# Altium project Active Sensor BB Rev 3.1old.PrjPcb
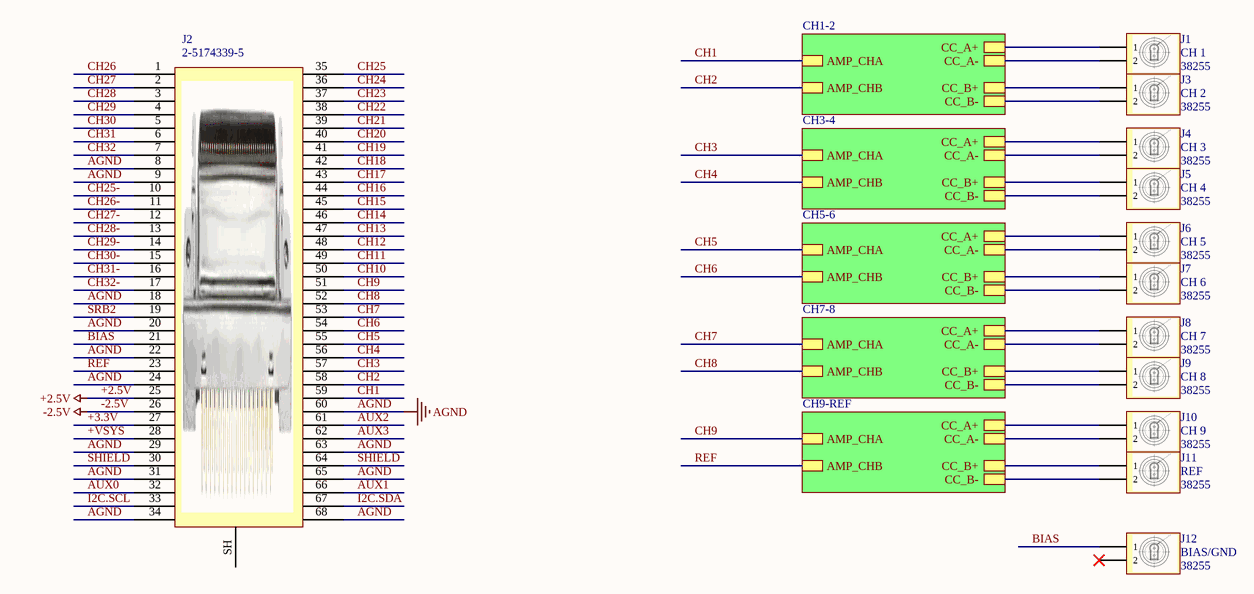
[diagram p0: Active Sensor BB.SchDoc]
PRJCOMPANY: X; PRJDATE: 12-18-18; PRJDOC: XXXXX; PRJENGINEER: N. HAMAN; PRJNAME: AMBER; PRJREV: 3.1
2 sheets, 107 parts. Net scope: hierarchical (ports join the sheet entries above them; power ports are global).
Board file: Active Sensor BB.PcbDoc
Sheets:
  Active Sensor BB.SchDoc
    CH1-2 = CC CHANNEL.SchDoc
    CH3-4 = CC CHANNEL.SchDoc
    CH5-6 = CC CHANNEL.SchDoc
    CH7-8 = CC CHANNEL.SchDoc
    CH9-REF = CC CHANNEL.SchDoc

## Sheet Active Sensor BB.SchDoc
size A4; Organization: Altium Limited; Address1: L3, 12a Rodborough Rd; Address2: Frenchs Forest; Address3: NSW; Address4: Australia 2086; SheetNumber: 1; SheetTotal: 2; TitleBlk1Sch: PCBA, A.E BREAKOUT, REV 3.1, AMBER; TitleBlk2Sch: Active Sensor Board; EngDate: 12-18-18; RevSch: 01; Eng: Haman

### Parts
J1  CH 1  [38255]
J2  10268-6212PC  [2-5174339-5]  (value not drawn)
J3  CH 2  [38255]
J4  CH 3  [38255]
J5  CH 4  [38255]
J6  CH 5  [38255]
J7  CH 6  [38255]
J8  CH 7  [38255]
J9  CH 8  [38255]
J10  CH 9  [38255]
J11  REF  [38255]
J12  BIAS/GND  [38255]

### Sub-sheets
CH1-2 = CC CHANNEL.SchDoc: CC_A+, CC_A-, AMP_CHA, AMP_CHB, CC_B+, CC_B-
CH3-4 = CC CHANNEL.SchDoc: CC_A+, CC_A-, AMP_CHA, AMP_CHB, CC_B+, CC_B-
CH5-6 = CC CHANNEL.SchDoc: CC_A+, CC_A-, AMP_CHA, AMP_CHB, CC_B+, CC_B-
CH7-8 = CC CHANNEL.SchDoc: CC_A+, CC_A-, AMP_CHA, AMP_CHB, CC_B+, CC_B-
CH9-REF = CC CHANNEL.SchDoc: CC_A+, CC_A-, AMP_CHA, AMP_CHB, CC_B+, CC_B-

### Nets
+2.5V: J2.25
-2.5V: J2.26
AGND: J2.8 J2.9 J2.18 J2.20 J2.22 J2.24 J2.29 J2.31 J2.34 J2.60 J2.63 J2.65 J2.68
+3.3V: J2.27
+VSYS: J2.28
AUX0: J2.32
AUX1: J2.66
AUX2: J2.61
AUX3: J2.62
BIAS: J2.21 J12.1
CC_A+: J1.1 ; sheet CH1-2/CC_A+
CC_A+: J4.1 ; sheet CH3-4/CC_A+  [a separate net that carries the same name]
CC_A+: J6.1 ; sheet CH5-6/CC_A+  [a separate net that carries the same name]
CC_A+: J8.1 ; sheet CH7-8/CC_A+  [a separate net that carries the same name]
CC_A+: J10.1 ; sheet CH9-REF/CC_A+  [a separate net that carries the same name]
CC_A-: J1.2 ; sheet CH1-2/CC_A-
CC_A-: J4.2 ; sheet CH3-4/CC_A-  [a separate net that carries the same name]
CC_A-: J6.2 ; sheet CH5-6/CC_A-  [a separate net that carries the same name]
CC_A-: J8.2 ; sheet CH7-8/CC_A-  [a separate net that carries the same name]
CC_A-: J10.2 ; sheet CH9-REF/CC_A-  [a separate net that carries the same name]
CC_B+: J3.1 ; sheet CH1-2/CC_B+
CC_B+: J5.1 ; sheet CH3-4/CC_B+  [a separate net that carries the same name]
CC_B+: J7.1 ; sheet CH5-6/CC_B+  [a separate net that carries the same name]
CC_B+: J9.1 ; sheet CH7-8/CC_B+  [a separate net that carries the same name]
CC_B+: J11.1 ; sheet CH9-REF/CC_B+  [a separate net that carries the same name]
CC_B-: J3.2 ; sheet CH1-2/CC_B-
CC_B-: J5.2 ; sheet CH3-4/CC_B-  [a separate net that carries the same name]
CC_B-: J7.2 ; sheet CH5-6/CC_B-  [a separate net that carries the same name]
CC_B-: J9.2 ; sheet CH7-8/CC_B-  [a separate net that carries the same name]
CC_B-: J11.2 ; sheet CH9-REF/CC_B-  [a separate net that carries the same name]
CH1: J2.59 ; sheet CH1-2/AMP_CHA
CH2: J2.58 ; sheet CH1-2/AMP_CHB
CH3: J2.57 ; sheet CH3-4/AMP_CHA
CH4: J2.56 ; sheet CH3-4/AMP_CHB
CH5: J2.55 ; sheet CH5-6/AMP_CHA
CH6: J2.54 ; sheet CH5-6/AMP_CHB
CH7: J2.53 ; sheet CH7-8/AMP_CHA
CH8: J2.52 ; sheet CH7-8/AMP_CHB
CH9: J2.51 ; sheet CH9-REF/AMP_CHA
CH10: J2.50
CH11: J2.49
CH12: J2.48
CH13: J2.47
CH14: J2.46
CH15: J2.45
CH16: J2.44
CH17: J2.43
CH18: J2.42
CH19: J2.41
CH20: J2.40
CH21: J2.39
CH22: J2.38
CH23: J2.37
CH24: J2.36
CH25: J2.35
CH25-: J2.10
CH26: J2.1
CH26-: J2.11
CH27: J2.2
CH27-: J2.12
CH28: J2.3
CH28-: J2.13
CH29: J2.4
CH29-: J2.14
CH30: J2.5
CH30-: J2.15
CH31: J2.6
CH31-: J2.16
CH32: J2.7
CH32-: J2.17
I2C.SCL: J2.33
I2C.SDA: J2.67
REF: J2.23 ; sheet CH9-REF/AMP_CHB
SHIELD: J2.30 J2.64
SRB2: J2.19

Not connected (* = marked no-connect by the designer): J2 SH; J12 2*

### Notes on the sheet
- Title:
- USA
- 100 Mayfield Avenue
- Mountain View, CA 94043
- Variant Name:
- Confidential and Proprietary
- Engineer:
- Date:
- Size:
- A4
- Template:
- 992-00283-00 A
- Dwg No:
- Sheet:
- Rev:
- of

### Library data of the parts
J1 J3-J12 = 38255: MANUFACTURER: PLASTICS1; DESCRIPTION1: TOUCHLESS CONNECTOR; MANUFACTURER PART NUMBER: 38255
J2 = 10268-6212PC: Manufacturer: TE Connectivity; Description1: TE CONNECTIVITY / AMP         2-5174339-5             Standard D Sub Connector, Vertical, AMPLIMITE 0.050 Series, Plug, 68 Contacts, Steel Body; 3D Model: 2-5174339-5.pdf; Connector Style: D-Type; Connector Type: Cap, Male Pins; Number of Positions: 68; Flange Feature: Housing/Shell (M2.5); Voltage Rating: 100V; Current Rating: 1A; Supplier 1: Digi-Key; Supplier Part Number 1: A121355-ND; Manufacturer Part Number: 2-5174339-5; Stock 1: 1867; Pricing 1: 1=20.4, 10=18.414, 25=17.6424, 50=16.5398, 100=15.9885, 250=15.1064, 500=14.6653 (USD); RoHS Information: 2-5174339-5 Statement of Compliance; Standard Package: 420; Category: Connectors, Interconnects; Family: D-Sub Connectors; Series: AMPLIMITE .050 II; Number of Rows: 2; Shell Size, Connector Layout: 0.050 Pitch x 0.100 Row to Row; Contact Type: Signal; Mounting Type: Through Hole; Termination: Solder; Features: Shielded; Shell Material, Finish: Zinc, Nickel Plated; Contact Finish: Gold; Contact Finish Thickness: 30µin (0.76µm); Operating Temperature: -55°C ~ 85°C; Housing Material: Polybutylene Terephthalate (PBT); Color: Black

## Sheet CC CHANNEL.SchDoc
size A4; Organization: Altium Limited; Address1: L3, 12a Rodborough Rd; Address2: Frenchs Forest; Address3: NSW; Address4: Australia 2086; SheetNumber: 2; SheetTotal: 2; TitleBlk1Sch: PCBA, A.E BREAKOUT, REV 3.1, AMBER; TitleBlk2Sch: CC Channel; Eng: Haman; RevSch: 01; EngDate: 12-18-19
Used 5 times, as channels CH1-2, CH3-4, CH5-6, CH7-8, CH9-REF. Parts and nets are listed once, with the designators drawn on the sheet.
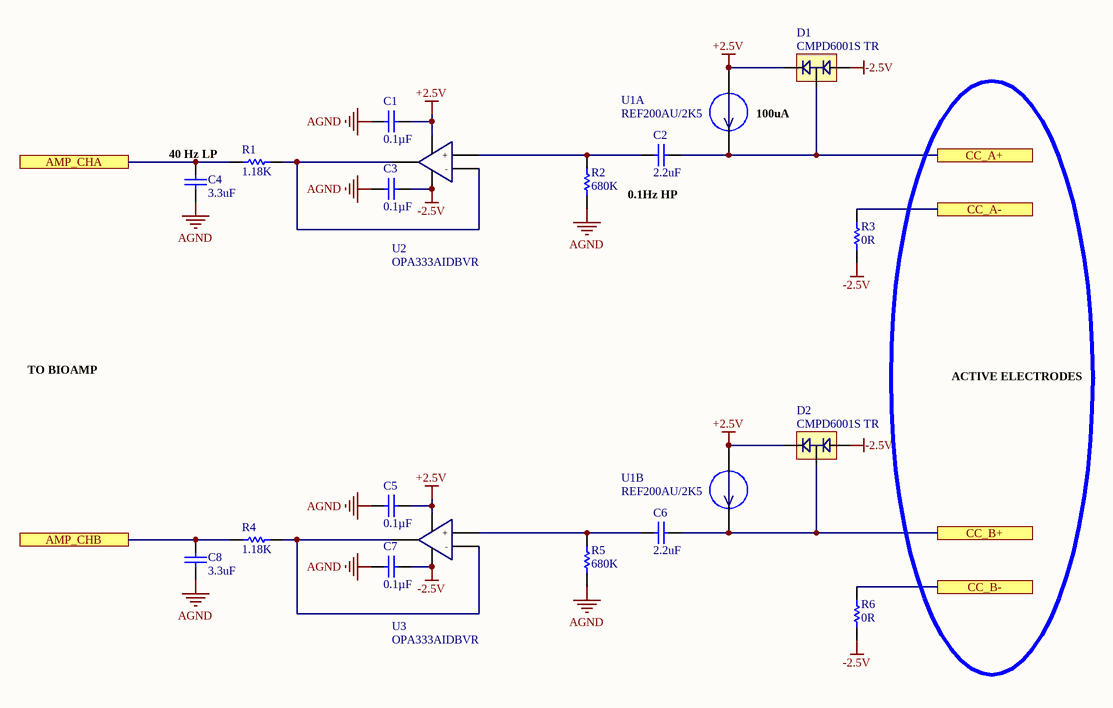
[diagram p1: CC CHANNEL.SchDoc]

### Parts
C1  Capacitance: 0.1µF  [0805C]
C2  Capacitance: 2.2uF  [0805C]  (hidden comment: 50V)
C3  Capacitance: 0.1µF  [0805C]
C4  Capacitance: 3.3uF  [0805C]
C5  Capacitance: 0.1µF  [0805C]
C6  Capacitance: 2.2uF  [0805C]  (hidden comment: 50V)
C7  Capacitance: 0.1µF  [0805C]
C8  Capacitance: 3.3uF  [0805C]
D1  CMPD6001S TR  [SOT-23]
D2  CMPD6001S TR  [SOT-23]
R1  Resistance (Ohms): 1.18K  [0805R]  (hidden comment: Res 0805)
R2  Resistance (Ohms): 680K  [0805R]  (hidden comment: Res 0805)
R3  Resistance (Ohms): 0R  [0805R]  (hidden comment: Res 0805)
R4  Resistance (Ohms): 1.18K  [0805R]  (hidden comment: Res 0805)
R5  Resistance (Ohms): 680K  [0805R]  (hidden comment: Res 0805)
R6  Resistance (Ohms): 0R  [0805R]  (hidden comment: Res 0805)
U1  REF200AU/2K5  [SOIC-8]  (parts A,B of 2)
U2  Manufacturer Part Number: OPA333AIDBVR  [SOT-23-5]  (hidden comment: LPV821DBVR)
U3  Manufacturer Part Number: OPA333AIDBVR  [SOT-23-5]  (hidden comment: LPV821DBVR)

### Ports
AMP_CHA, AMP_CHB, CC_A+, CC_A-, CC_B+, CC_B-

### Nets
+2.5V: C1.2 C5.2 D1.2 D2.2 U1.7(I2_HIGH) U1.8(I1_HIGH) U2.5(VCC) U3.5(VCC)
-2.5V: C3.2 C7.2 D1.1 D2.1 R3.1 R6.1 U2.2(VDD) U3.2(VDD)
AGND: C1.1 C3.1 C4.1 C5.1 C7.1 C8.1 R2.1 R5.1
AMP_CHA: C4.2 R1.2 ; port AMP_CHA
AMP_CHB: C8.2 R4.2 ; port AMP_CHB
CC_A+: C2.1 D1.3 U1.1(I1_LOW) ; port CC_A+
CC_A-: R3.2 ; port CC_A-
CC_B+: C6.1 D2.3 U1.2(I2_LOW) ; port CC_B+
CC_B-: R6.2 ; port CC_B-
NetC2_2: C2.2 R2.2 U2.3(+)
NetC6_2: C6.2 R5.2 U3.3(+)
NetR1_1: R1.1 U2.1(OUT) U2.4(-)
NetR4_1: R4.1 U3.1(OUT) U3.4(-)

### Channels
CH1-2: designators end in A; ports AMP_CHA=CH1 AMP_CHB=CH2 CC_A+=CC_A+ CC_A-=CC_A- CC_B+=CC_B+ CC_B-=CC_B-
CH3-4: designators end in B; ports AMP_CHA=CH3 AMP_CHB=CH4 CC_A+=CC_A+ CC_A-=CC_A- CC_B+=CC_B+ CC_B-=CC_B-
CH5-6: designators end in C; ports AMP_CHA=CH5 AMP_CHB=CH6 CC_A+=CC_A+ CC_A-=CC_A- CC_B+=CC_B+ CC_B-=CC_B-
CH7-8: designators end in D; ports AMP_CHA=CH7 AMP_CHB=CH8 CC_A+=CC_A+ CC_A-=CC_A- CC_B+=CC_B+ CC_B-=CC_B-
CH9-REF: designators end in E; ports AMP_CHA=CH9 AMP_CHB=REF CC_A+=CC_A+ CC_A-=CC_A- CC_B+=CC_B+ CC_B-=CC_B-

### Notes on the sheet
- 100uA
- (near C4) 40 Hz LP
- 0.1Hz HP
- TO BIOAMP
- ACTIVE ELECTRODES
- Title:
- USA
- 100 Mayfield Avenue
- Mountain View, CA 94043
- Variant Name:
- Confidential and Proprietary
- Engineer:
- Date:
- Size:
- A4
- Template:
- 992-00283-00 A
- Dwg No:
- Sheet:
- Rev:
- of

### Library data of the parts
C1 C3 C5 C7 = Cap: CAP .1UF 50V CERAMIC Y5V 0805; Manufacturer: AVX Corporation; Manufacturer Part Number: 08055C104KAT2A; Description1: CAP CER 0.1UF 50V X7R 0805; Tolerance: ±10%; Temperature Coefficient: X7R; Revision: July-2002: Re-released for DXP Platform.; Supplier 1: Digi-Key; Supplier Part Number 1: 478-1395-1-ND; RoHS: RoHS Compliant; Category: Capacitors; Stock 1: 5022563; Pricing 1: 1=0.1, 10=0.036, 25=0.0264, 50=0.0198, 100=0.0162, 250=0.01352, 500=0.01156, 1000=0.00908 (USD); Packaging: Cut Tape (CT); Part Status: Active; Voltage - Rated: 50V; Mounting Type: Surface Mount, MLCC; Operating Temperature: -55°C ~ 125°C; Applications: General Purpose; Ratings: -; Package / Case: 0805 (2012 Metric); Size / Dimension: 0.079" L x 0.049" W (2.01mm x 1.25mm); Height - Seated (Max): -; Thickness (Max): 0.037" (0.94mm); Lead Spacing: -; Features: -; Lead Style: -; ComponentLink1URL: http://datasheets.avx.com/X7RDielectric.pdf; ComponentLink1Description: http://datasheets.avx.com/X7RDielectric.pdf
C2 C6 = Cap: CAP .1UF 50V CERAMIC Y5V 0805; Manufacturer: Yageo; Manufacturer Part Number: CC0805MRX5R6BB225; Description1: CAP CER 2.2UF 10V X5R 0805; Tolerance: ±20%; Voltage - Rated: 10V; Temperature Coefficient: X5R; Notification: Current market demand for these product types have resulted in fluctuating and extending lead times. Lead times may differ.; Revision: July-2002: Re-released for DXP Platform.; Supplier 1: Digi-Key; Supplier Part Number 1: 311-3438-1-ND; RoHS: RoHS Compliant; Category: Capacitors; Stock 1: 31890; Pricing 1: 1=0.24, 10=0.161, 100=0.0818, 500=0.05598, 1000=0.04951 (USD); Packaging: Cut Tape (CT); Part Status: Active; Operating Temperature: -55°C ~ 85°C; Features: -; Ratings: -; Applications: General Purpose; Failure Rate: -; Mounting Type: Surface Mount, MLCC; Package / Case: 0805 (2012 Metric); Size / Dimension: 0.079" L x 0.049" W (2.00mm x 1.25mm); Height - Seated (Max): -; Thickness (Max): 0.037" (0.95mm); Lead Spacing: -; Lead Style: -; ComponentLink1URL: http://www.yageo.com/documents/recent/UPY-GPHC_X5R_4V-to-50V_25.pdf; ComponentLink1Description: http://www.yageo.com/documents/recent/UPY-GPHC_X5R_4V-to-50V_25.pdf
C4 C8 = Cap: CAP .1UF 50V CERAMIC Y5V 0805; Manufacturer: TDK Corporation; Manufacturer Part Number: CGA4J3X7R1C335K125AB; Description1: CAP CER 3.3UF 16V X7R 0805; Tolerance: ±10%; Voltage - Rated: 16V; Temperature Coefficient: X7R; Revision: July-2002: Re-released for DXP Platform.; Supplier 1: Digi-Key; Supplier Part Number 1: 445-12736-1-ND; RoHS: RoHS Compliant; Category: Capacitors; Stock 1: 20000; Pricing 1: 1=0.55, 10=0.38, 100=0.2277, 500=0.17078, 1000=0.14421 (USD); Packaging: Cut Tape (CT); Part Status: Active; Operating Temperature: -55°C ~ 125°C; Features: -; Ratings: AEC-Q200; Applications: Automotive; Failure Rate: -; Mounting Type: Surface Mount, MLCC; Package / Case: 0805 (2012 Metric); Size / Dimension: 0.079" L x 0.049" W (2.00mm x 1.25mm); Height - Seated (Max): -; Thickness (Max): 0.057" (1.45mm); Lead Spacing: -; Lead Style: -; ComponentLink1URL: https://product.tdk.com/info/en/catalog/datasheets/mlcc_automotive_general_en.pdf; ComponentLink1Description: https://product.tdk.com/info/en/catalog/datasheets/mlcc_automotive_general_en.pdf
D1 D2 = CMPD6001S TR: Manufacturer: Central Semiconductor Corp; Description1: DIODE ARRAY GP 75V 250MA SOT23; Diode Configuration: 1 Pair Series Connection; Diode Type: Standard; Voltage - DC Reverse (Vr) (Max): 75V; Current - Average Rectified (Io) (per Diode): 250mA; Voltage - Forward (Vf) (Max) @ If: 1.1V @ 100mA; Speed: Fast Recovery =< 500ns, > 200mA (Io); Reverse Recovery Time (trr): 3µs; Current - Reverse Leakage @ Vr: 500pA @ 75V; Supplier 1: Digi-Key; Supplier Part Number 1: CMPD6001S CT-ND; RoHS: RoHS Compliant; Category: Discrete Semiconductor Products; Stock 1: 7051; Pricing 1: 1=0.89, 10=0.872, 25=0.7868, 100=0.6885, 250=0.60376, 500=0.53548, 750=0.46717, 1000=0.42346 (USD); Packaging: Cut Tape (CT); Part Status: Active; Mounting Type: Surface Mount; Package / Case: TO-236-3, SC-59, SOT-23-3; Supplier Device Package: SOT-23; ComponentLink1URL: http://www.centralsemi.com/PDFs/products/CMPD6001-A-C-S_R1.PDF; ComponentLink1Description: http://www.centralsemi.com/PDFs/products/CMPD6001-A-C-S_R1.PDF; Manufacturer Part Number: CMPD6001S TR
R1 R4 = Res 0805: Resistor; Manufacturer: Yageo; Manufacturer Part Number: RC0805FR-071K18L; Description1: RES SMD 1.18K OHM 1% 1/8W 0805; Tolerance: ±1%; Power (Watts): 0.125W, 1/8W; Temperature Coefficient: ±100ppm/°C; Supplier 1: Digi-Key; Supplier Part Number 1: 311-1.18KCRCT-ND; RoHS: RoHS Compliant; Category: Resistors; Stock 1: 178716; Pricing 1: 1=0.1, 10=0.042, 100=0.0169, 1000=0.00759, 2500=0.00659 (USD); Packaging: Cut Tape (CT); Part Status: Active; Composition: Thick Film; Features: Moisture Resistant; Operating Temperature: -55°C ~ 155°C; Package / Case: 0805 (2012 Metric); Supplier Device Package: 0805; Size / Dimension: 0.079" L x 0.049" W (2.00mm x 1.25mm); Height - Seated (Max): 0.024" (0.60mm); Failure Rate: -; ComponentLink1URL: http://www.yageo.com/documents/recent/PYu-RC_Group_51_RoHS_L_9.pdf; ComponentLink1Description: http://www.yageo.com/documents/recent/PYu-RC_Group_51_RoHS_L_9.pdf
R2 R5 = Res 0805: Resistor; Manufacturer: Panasonic Electronic Components; Manufacturer Part Number: ERJ-6ENF6803V; Description1: RES SMD 680K OHM 1% 1/8W 0805; Tolerance: ±1%; Power (Watts): 0.125W, 1/8W; Temperature Coefficient: ±100ppm/°C; Supplier 1: Digi-Key; Supplier Part Number 1: P680KCCT-ND; RoHS: RoHS Compliant; Category: Resistors; Stock 1: 73875; Pricing 1: 1=0.1, 10=0.079, 100=0.0305, 1000=0.0134, 2500=0.01157 (USD); Packaging: Cut Tape (CT); Part Status: Active; Composition: Thick Film; Features: Automotive AEC-Q200; Operating Temperature: -55°C ~ 155°C; Package / Case: 0805 (2012 Metric); Supplier Device Package: 0805; Size / Dimension: 0.079" L x 0.049" W (2.00mm x 1.25mm); Height - Seated (Max): 0.028" (0.70mm); Failure Rate: -; ComponentLink1URL: https://industrial.panasonic.com/cdbs/www-data/pdf/RDA0000/AOA0000C304.pdf; ComponentLink1Description: https://industrial.panasonic.com/cdbs/www-data/pdf/RDA0000/AOA0000C304.pdf
R3 R6 = Res 0805: Resistor; Manufacturer: Panasonic Electronic Components; Manufacturer Part Number: ERJ-6GEY0R00V; Description1: RES SMD 0.0 OHM JUMPER 1/8W 0805; Tolerance: Jumper; Power (Watts): 0.125W, 1/8W; Supplier 1: Digi-Key; Supplier Part Number 1: P0.0ACT-ND; RoHS: RoHS Compliant; Category: Resistors; Stock 1: 3456609; Pricing 1: 1=0.1, 50=0.0196, 100=0.0149, 250=0.01104, 500=0.00816, 1000=0.00544, 2500=0.00459 (USD); Packaging: Cut Tape (CT); Part Status: Active; Composition: Thick Film; Features: Automotive AEC-Q200; Temperature Coefficient: -; Operating Temperature: -55°C ~ 155°C; Package / Case: 0805 (2012 Metric); Supplier Device Package: 0805; Size / Dimension: 0.079" L x 0.049" W (2.00mm x 1.25mm); Height: 0.028" (0.70mm); Number of Terminations: 2; ComponentLink1URL: http://industrial.panasonic.com/www-cgi/jvcr13pz.cgi?E+PZ+3+AOA0001+ERJ6GEY0R00V+7+WW; ComponentLink1Description: http://industrial.panasonic.com/www-cgi/jvcr13pz.cgi?E+PZ+3+AOA0001+ERJ6GEY0R00V+7+WW
U1 = REF200AU/2K5: Manufacturer: Texas Instruments; Description1: IC CURR SOURCE/SINK MIRROR 8SOIC; Function: Current Mirror, Current Sink/Source; Accuracy: ±0.25%; Voltage - Input: 2.5 V ~ 40 V; Current - Output: 100µA; Supplier 1: Digi-Key; Supplier Part Number 1: 296-27726-1-ND; RoHS: RoHS Compliant; Category: Integrated Circuits (ICs); Stock 1: 10238; Pricing 1: 1=7.65, 10=6.909, 100=5.7202, 500=4.98108, 1000=4.33836 (USD); Packaging: Cut Tape (CT); Part Status: Active; Sensing Method: -; Operating Temperature: -25°C ~ 85°C; Mounting Type: Surface Mount; Package / Case: 8-SOIC (0.154", 3.90mm Width); Supplier Device Package: 8-SOIC; Base Part Number: REF200; ComponentLink1URL: http://www.ti.com/lit/ds/symlink/ref200.pdf; ComponentLink1Description: http://www.ti.com/lit/ds/symlink/ref200.pdf; Manufacturer Part Number: REF200AU/2K5
U2 U3 = LPV821DBVR: Manufacturer: Texas Instruments; Description1: IC OPAMP CHOPPER 350KHZ SOT23-5; Rail/Rail I/O Type: Rail to Rail Input/Output; Number of  Elements: 1; Unity Gain Bandwidth Product: 0.35MHz; Slew Rate: 0.16V/us; Common Mode Rejection Ratio: 106dB; Input Offset Voltage: 10uV; Input Bias Current: 200pA; Single Supply Voltage (Typ): 3/5V; Voltage Gain in dB: 130dB; Power Supply Rejection Ratio: 120dB; Power Supply Requirement: Single/Dual; Shut Down Feature: No; Single Supply Voltage (Min): 1.8V; Single Supply Voltage (Max): 5.5V; Dual Supply Voltage (Min): ±0.9V; Dual Supply Voltage (Max): ±2.75V; Supplier 1: Digi-Key; Supplier Part Number 1: 296-26269-1-ND; Stock 1: 10811; Pricing 1: 1=2.54, 10=2.282, 100=1.8341, 500=1.5069, 1000=1.2486 (USD); Type: General Purpose Amplifier; Technology: CMOS; Operating Temp Range: -40C to 125C; Operating Temperature Classification: Automotive; Mounting: Surface Mount; Pin Count: 5; Package Type: SOT-23; Packaging: Tape and Reel

## Nets that join several sheets
+2.5V: Active Sensor BB (J2.25), CH1-2 (8 pins), CH3-4 (8 pins), CH5-6 (8 pins), CH7-8 (8 pins), CH9-REF (8 pins)
-2.5V: Active Sensor BB (J2.26), CH1-2 (8 pins), CH3-4 (8 pins), CH5-6 (8 pins), CH7-8 (8 pins), CH9-REF (8 pins)
AGND: Active Sensor BB (13 pins), CH1-2 (8 pins), CH3-4 (8 pins), CH5-6 (8 pins), CH7-8 (8 pins), CH9-REF (8 pins)
CC_A+: Active Sensor BB (J1.1), CH1-2 (C2A.1 D1A.3 U1A.1)
CC_A+: Active Sensor BB (J4.1), CH3-4 (C2B.1 D1B.3 U1B.1)
CC_A+: Active Sensor BB (J6.1), CH5-6 (C2C.1 D1C.3 U1C.1)
CC_A+: Active Sensor BB (J8.1), CH7-8 (C2D.1 D1D.3 U1D.1)
CC_A+: Active Sensor BB (J10.1), CH9-REF (C2E.1 D1E.3 U1E.1)
CC_A-: Active Sensor BB (J1.2), CH1-2 (R3A.2)
CC_A-: Active Sensor BB (J4.2), CH3-4 (R3B.2)
CC_A-: Active Sensor BB (J6.2), CH5-6 (R3C.2)
CC_A-: Active Sensor BB (J8.2), CH7-8 (R3D.2)
CC_A-: Active Sensor BB (J10.2), CH9-REF (R3E.2)
CC_B+: Active Sensor BB (J3.1), CH1-2 (C6A.1 D2A.3 U1A.2)
CC_B+: Active Sensor BB (J5.1), CH3-4 (C6B.1 D2B.3 U1B.2)
CC_B+: Active Sensor BB (J7.1), CH5-6 (C6C.1 D2C.3 U1C.2)
CC_B+: Active Sensor BB (J9.1), CH7-8 (C6D.1 D2D.3 U1D.2)
CC_B+: Active Sensor BB (J11.1), CH9-REF (C6E.1 D2E.3 U1E.2)
CC_B-: Active Sensor BB (J3.2), CH1-2 (R6A.2)
CC_B-: Active Sensor BB (J5.2), CH3-4 (R6B.2)
CC_B-: Active Sensor BB (J7.2), CH5-6 (R6C.2)
CC_B-: Active Sensor BB (J9.2), CH7-8 (R6D.2)
CC_B-: Active Sensor BB (J11.2), CH9-REF (R6E.2)
CH1: Active Sensor BB (J2.59), CH1-2 (C4A.2 R1A.2)
CH2: Active Sensor BB (J2.58), CH1-2 (C8A.2 R4A.2)
CH3: Active Sensor BB (J2.57), CH3-4 (C4B.2 R1B.2)
CH4: Active Sensor BB (J2.56), CH3-4 (C8B.2 R4B.2)
CH5: Active Sensor BB (J2.55), CH5-6 (C4C.2 R1C.2)
CH6: Active Sensor BB (J2.54), CH5-6 (C8C.2 R4C.2)
CH7: Active Sensor BB (J2.53), CH7-8 (C4D.2 R1D.2)
CH8: Active Sensor BB (J2.52), CH7-8 (C8D.2 R4D.2)
CH9: Active Sensor BB (J2.51), CH9-REF (C4E.2 R1E.2)
REF: Active Sensor BB (J2.23), CH9-REF (C8E.2 R4E.2)

## Assembly variants
PRODUCTION: not fitted J5 J6 J7 J8 J9 J10